# Altium schematic sheet ADCCircuit.SchDoc
size 420 x 297 mm; SheetNumber: 6; SheetTotal: 9
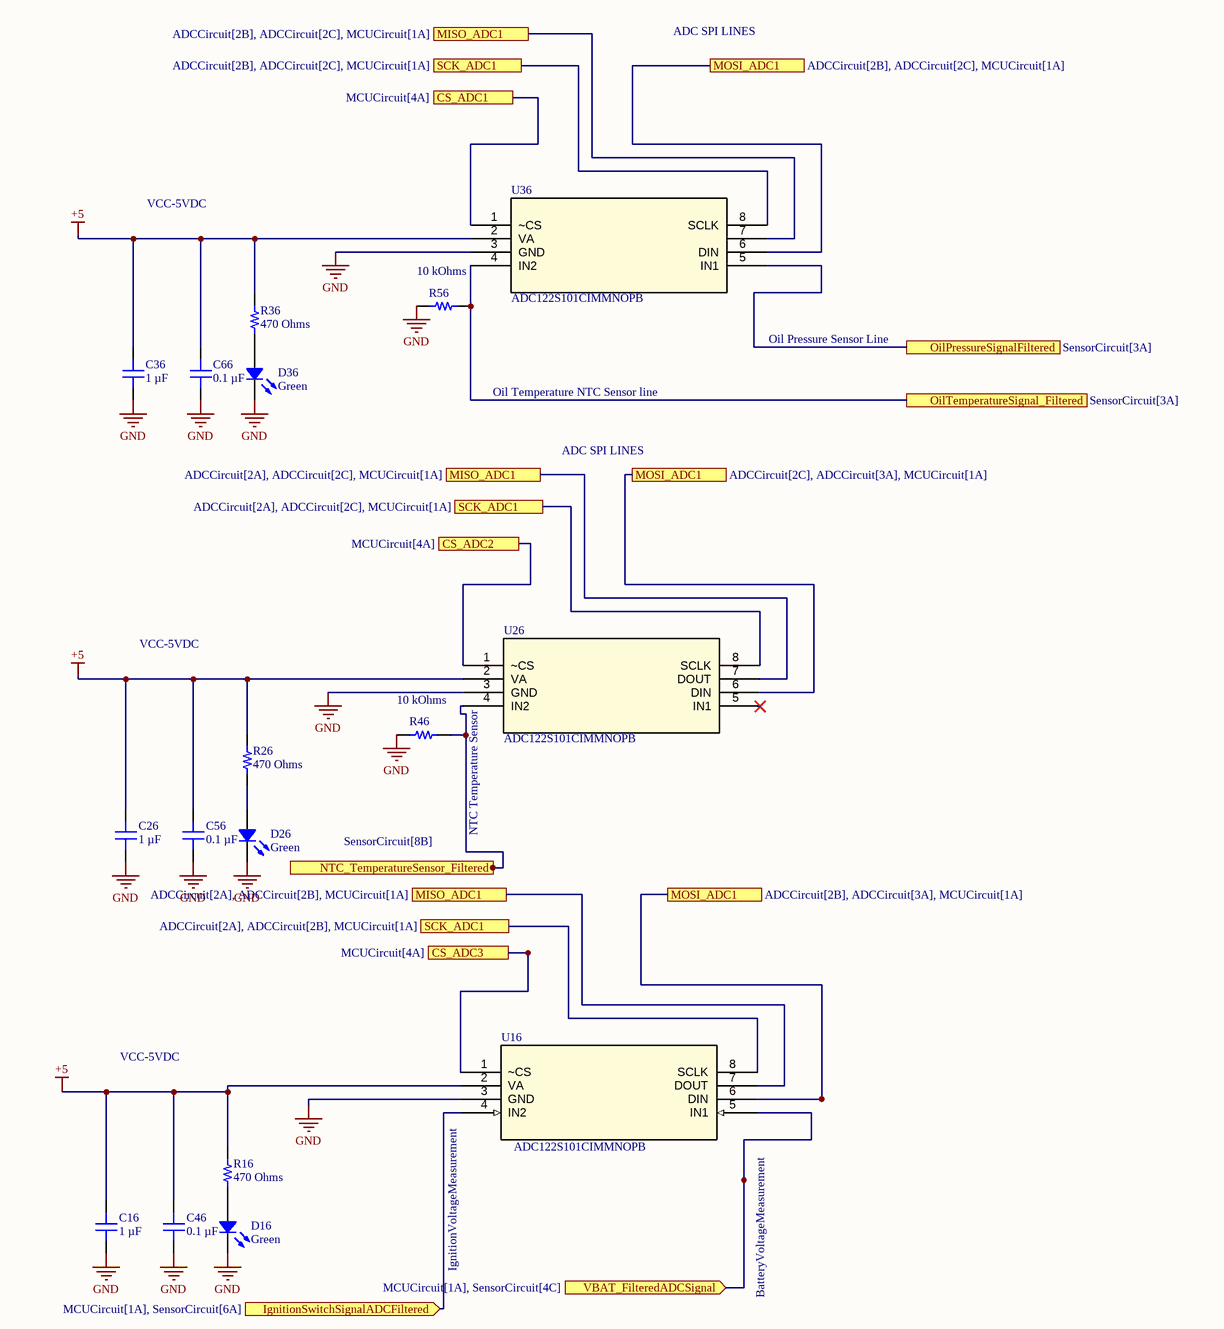
[diagram p0: ADCCircuit.SchDoc]

## Parts
C16  1 µF  [C0805]
C26  1 µF  [C0805]
C36  1 µF  [C0805]
C46  0.1 µF  [C0805]
C56  0.1 µF  [C0805]
C66  0.1 µF  [C0805]
D16  Green  [LED 0805_2012 GREEN]
D26  Green  [LED 0805_2012 GREEN]
D36  Green  [LED 0805_2012 GREEN]
R16  470 Ohms  [RES 0805_2012]
R26  470 Ohms  [RES 0805_2012]
R36  470 Ohms  [RES 0805_2012]
R46  10 kOhms  [RES 0805_2012]
R56  10 kOhms  [RES 0805_2012]
U16  ADC122S101CIMMNOPB  [MUA08A]
U26  ADC122S101CIMMNOPB  [MUA08A]
U36  ADC122S101CIMMNOPB  [MUA08A]

## Ports
CS_ADC1 (see MCUCircuit[4A]), CS_ADC2 (see MCUCircuit[4A]), CS_ADC3 (see MCUCircuit[4A]), IgnitionSwitchSignalADCFiltered (in, see MCUCircuit[1A], SensorCircuit[6A]), MISO_ADC1 (see ADCCircuit[2A], ADCCircuit[2B], MCUCircuit[1A]), MISO_ADC1 (see ADCCircuit[2A], ADCCircuit[2C], MCUCircuit[1A]), MISO_ADC1 (see ADCCircuit[2B], ADCCircuit[2C], MCUCircuit[1A]), MOSI_ADC1 (see ADCCircuit[2B], ADCCircuit[2C], MCUCircuit[1A]), MOSI_ADC1 (see ADCCircuit[2B], ADCCircuit[3A], MCUCircuit[1A]), MOSI_ADC1 (see ADCCircuit[2C], ADCCircuit[3A], MCUCircuit[1A]), NTC_TemperatureSensor_Filtered (see SensorCircuit[8B]), OilPressureSignalFiltered (see SensorCircuit[3A]), OilTemperatureSignal_Filtered (see SensorCircuit[3A]), SCK_ADC1 (see ADCCircuit[2A], ADCCircuit[2B], MCUCircuit[1A]), SCK_ADC1 (see ADCCircuit[2A], ADCCircuit[2C], MCUCircuit[1A]), SCK_ADC1 (see ADCCircuit[2B], ADCCircuit[2C], MCUCircuit[1A]), VBAT_FilteredADCSignal (in, see MCUCircuit[1A], SensorCircuit[4C])

## Nets
+5: C16.2 C26.2 C36.2 C46.2 C56.2 C66.2 R16.2 R26.2 R36.2 U16.2(VA) U26.2(VA) U36.2(VA)
GND: C16.1 C26.1 C36.1 C46.1 C56.1 C66.1 D16.2 D26.2 D36.2 R46.1 R56.1 U16.3(GND) U26.3(GND) U36.3(GND)
CS_ADC1: U36.1(~CS) ; port CS_ADC1
CS_ADC2: U26.1(~CS) ; port CS_ADC2
CS_ADC3: U16.1(~CS) ; port CS_ADC3
IgnitionSwitchSignalADCFiltered: U16.4(IN2) ; port IgnitionSwitchSignalADCFiltered
MISO_ADC1: U16.7(DOUT) U26.7(DOUT) U36.7(DOUT) ; port MISO_ADC1
MOSI_ADC1: U16.6(DIN) U26.6(DIN) U36.6(DIN) ; port MOSI_ADC1
NTC_TemperatureSensor_Filtered: R46.2 U26.4(IN2) ; port NTC_TemperatureSensor_Filtered
OilPressureSignalFiltered: U36.5(IN1) ; port OilPressureSignalFiltered
OilTemperatureSignal_Filtered: R56.2 U36.4(IN2) ; port OilTemperatureSignal_Filtered
SCK_ADC1: U16.8(SCLK) U26.8(SCLK) U36.8(SCLK) ; port SCK_ADC1
VBAT_FilteredADCSignal: U16.5(IN1) ; port VBAT_FilteredADCSignal
NetD16_1: D16.1 R16.1
NetD26_1: D26.1 R26.1
NetD36_1: D36.1 R36.1

Not connected (* = marked no-connect by the designer): U26 5(IN1)*

## Notes on the sheet
- ADC SPI LINES
- VCC-5VDC
- Oil Pressure Sensor Line
- Oil Temperature NTC Sensor line
- NTC Temperature Sensor
- (near U16) IgnitionVoltageMeasurement
- (near U16) BatteryVoltageMeasurement
- THIS DOCUMENT AND THE DATA DISCLOSED HEREIN OR
- HEREWITH IS THE PROPERTY OF ALTIUM LIMITED AND MAY
- DWG NO:
- REVISION
- REV:
- DESCRIPTION
- DATE
- APPROVED
- BE FREELY DISTRIBUTED IN WHOLE. NO RIGHTS ARE
- RESERVED OR EXPRESS OR IMPLIED WARANTEE GIVEN.
- ENG:
- APPROVALS
- PROJECT
- DSN:
- CHK:
- REFERENCE DOCUMENTS
- PROJECT REVISION:
- TITLE
- DOCUMENT REVISION:
- DESIGN ITEM:
- BOM:
- FAB DWG:
- PCB DWG:
- ASSY DWG:
- SCALE:
- A3
- SIZE
- CAGE CODE
- FILE NAME
- DWG NO.
- SHEET
- OF
- REV

## Library data of the parts
C16 C26 C36 = EMK212B7105KGHTR: CAP CER 1UF 16V X7R 0805; manufacturer: Taiyo Yuden; Tolerance: ±10%; Part Number: EMK212B7105KGHTR; Value: 1 µF; Applications: Automotive; Capacitance: 1 µF; componentlink1description: Datasheet; componentlink1url: https://ds.yuden.co.jp/TYCOMPAS/ut/detail?pn=EMK212B7105KGHTR &u=M; componentlink2description: DigiKey Link; componentlink2url: https://www.digikey.com/en/products/detail/taiyo-yuden/EMK212B7105KGHTR/6563155; Device Package: 0805 (2012 Metric); lastupdated: 2/9/2024 20:16:06; Lifecycle Status: Active; Minimum Order: 1; Mounting Type: Surface Mount, MLCC; Operating Temperature: -55°C ~ 125°C; Package / Case: 0805 (2012 Metric); packaging: TapeAndReel; partid: 3641; Part Status: Active; price: 0.03; Ratings: AEC-Q200; series: M; Size / Dimension: 0.079" L x 0.049" W (2.00mm x 1.25mm); Supplier 1: DigiKey; Supplier Part Number 1: 587-6310-1-ND; Temperature Coefficient: X7R; Thickness (Max): 0.053" (1.35mm); Voltage - Rated: 16V
C46 C56 C66 = 0805B104K160CT: CAP CER 0.1UF 16V X7R 0805; manufacturer: Walsin Technology Corporation; Tolerance: ±10%; Part Number: 0805B104K160CT; Value: 0.1 µF; Applications: General Purpose; Capacitance: 0.1 µF; componentlink1description: Datasheet; componentlink1url: http://www.passivecomponent.com/wp-content/uploads/2018/10/MLCC.pdf; componentlink2description: DigiKey Link; componentlink2url: https://www.digikey.com/en/products/detail/walsin-technology-corporation/0805B104K160CT/9355062; Device Package: 0805 (2012 Metric); lastupdated: 2/9/2024 20:16:02; Lifecycle Status: Active; Minimum Order: 1; Mounting Type: Surface Mount, MLCC; Operating Temperature: -55°C ~ 125°C; Package / Case: 0805 (2012 Metric); packaging: TapeAndReel; partid: 4882; Part Status: Active; price: 0.01; series: -; Size / Dimension: 0.079" L x 0.049" W (2.00mm x 1.25mm); Supplier 1: DigiKey; Supplier Part Number 1: 1292-1565-1-ND; Temperature Coefficient: X7R; Thickness (Max): 0.035" (0.90mm); Voltage - Rated: 16V
D16 D26 D36 = SM0805UGC: LED GREEN CLEAR 0805 SMD; Manufacturer: Bivar Inc.; Configuration: Standard; Current - Test: 20mA; Lens Color: Colorless; Lens Size: 1.40mm x 1.20mm; Lens Style: Rectangle with Flat Top; Millicandela Rating: 10mcd; Viewing Angle: 130°; Voltage - Forward (Vf) (Typ): 2V; Wavelength - Dominant: 565nm; Wavelength - Peak: 563nm; Part Number: SM0805UGC; Color: Green; ComponentLink1Description: Datasheet; ComponentLink1URL: https://www.bivar.com/Files/Datasheets/SM0805UGC.pdf; ComponentLink2Description: DigiKey Link; ComponentLink2URL: https://www.digikey.com/en/products/detail/bivar-inc/SM0805UGC/2408549; Device Package: 0805 (2012 Metric); Height (Max): 1.10mm; LastUpdated: 3/11/2024 07:52:46; Lens Transparency: Clear; Lifecycle Status: Active; Minimum Order: 1; Mounting Type: Surface Mount; Package / Case: 0805 (2012 Metric); Packaging: TapeAndReel; PartId: 247; Part Status: Active; Price: 0.19; Series: -; Size / Dimension: 2.00mm L x 1.20mm W; Supplier 1: DigiKey; Supplier Part Number 1: 492-1329-1-ND; Supplier Device Package: 0805; Value: Green
R16 R26 R36 = AC0805JR-07470RL: RES SMD 470 OHM 5% 1/8W 0805; Manufacturer: Yageo; Power (Watts): 0.125W, 1/8W; Temperature Coefficient: ±100ppm/°C; Part Number: AC0805JR-07470RL; Value: 470 Ohms; ComponentLink1Description: Datasheet; ComponentLink1URL: https://www.yageo.com/upload/media/product/productsearch/datasheet/rchip/PYu-AC_51_RoHS_L_7.pdf; ComponentLink2Description: DigiKey Link; ComponentLink2URL: https://www.digikey.com/en/products/detail/yageo/AC0805JR-07470RL/5897150; Composition: Thick Film; Device Package: 0805 (2012 Metric); Features: Automotive AEC-Q200, Moisture Resistant; Height - Seated (Max): 0.024" (0.60mm); LastUpdated: 2/8/2024 21:01:17; Lifecycle Status: Active; Minimum Order: 1; Number of Terminations: 2; Operating Temperature: -55°C ~ 155°C; Package / Case: 0805 (2012 Metric); Packaging: TapeAndReel; PartId: 46466; Part Status: Active; Price: 0.01; Ratings: AEC-Q200; Resistance: 470 Ohms; Series: AC; Size / Dimension: 0.079" L x 0.049" W (2.00mm x 1.25mm); Supplier 1: DigiKey; Supplier Part Number 1: YAG3791CT-ND; Supplier Device Package: 0805; Tolerance: ±5%
R46 R56 = 9-2176375-1: RES 10K OHM 0.1% 1/5W 0805; Manufacturer: TE Connectivity Passive Product; Power (Watts): 0.2W, 1/5W; Temperature Coefficient: ±10ppm/°C; Part Number: 9-2176375-1; Value: 10 kOhms; ComponentLink1Description: Datasheet; ComponentLink1URL: https://www.te.com/usa-en/product-9-2176375-1.datasheet.pdf; ComponentLink2Description: DigiKey Link; ComponentLink2URL: https://www.digikey.com/en/products/detail/te-connectivity-passive-product/9-2176375-1/18110542; Composition: Thin Film; Device Package: 0805 (2012 Metric); Features: Anti-Sulfur, Automotive AEC-Q200, Moisture Resistant; Height - Seated (Max): 0.026" (0.65mm); LastUpdated: 2/8/2024 21:00:11; Lifecycle Status: Active; Minimum Order: 1; Number of Terminations: 2; Operating Temperature: -55°C ~ 155°C; Package / Case: 0805 (2012 Metric); Packaging: TapeAndReel; PartId: 76290; Part Status: Active; Price: 0.39; Ratings: AEC-Q200; Resistance: 10 kOhms; Series: RQ73; Size / Dimension: 0.079" L x 0.049" W (2.00mm x 1.25mm); Supplier 1: DigiKey; Supplier Part Number 1: 1712-9-2176375-1CT-ND; Supplier Device Package: 0805; Tolerance: ±0.1%
U16 U26 U36 = ADC122S101CIMMNOPB: No Description Available; Mfr_Name: Texas Instruments; Type: ADC122S101CIMM; RefDes: RefDes